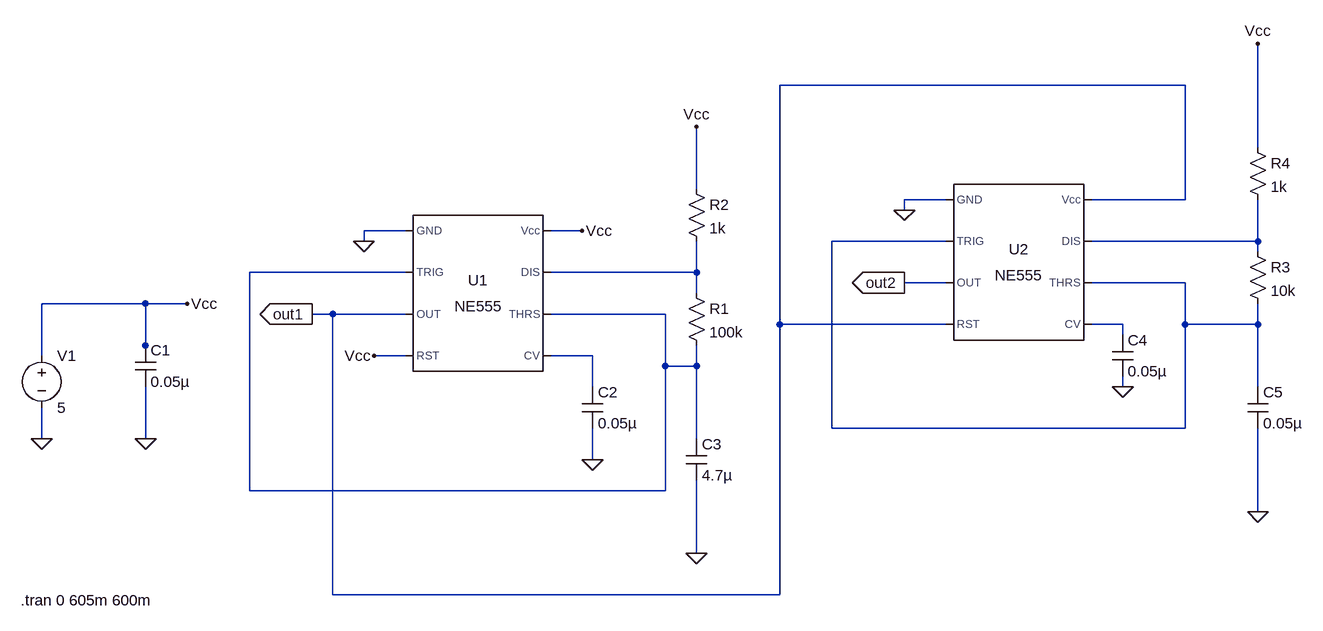
[diagram p0: schematic Double_Astable_Multivibrator.asc]
Double_Astable_Multivibrator.asc, the LTspice schematic file:
Version 4
SHEET 1 1996 680
WIRE 1680 -304 1056 -304
WIRE 1792 -208 1792 -368
WIRE 928 -144 928 -240
WIRE 1312 -128 1248 -128
WIRE 1680 -128 1680 -304
WIRE 1680 -128 1536 -128
WIRE 1248 -112 1248 -128
WIRE 480 -80 416 -80
WIRE 752 -80 704 -80
WIRE 416 -64 416 -80
WIRE 1312 -64 1136 -64
WIRE 1792 -64 1792 -128
WIRE 1792 -64 1536 -64
WIRE 1792 -48 1792 -64
WIRE 480 -16 240 -16
WIRE 928 -16 928 -64
WIRE 928 -16 704 -16
WIRE 1312 0 1248 0
WIRE 1680 0 1536 0
WIRE 928 16 928 -16
WIRE 80 32 -80 32
WIRE 144 32 80 32
WIRE 368 48 336 48
WIRE 480 48 368 48
WIRE 880 48 704 48
WIRE 1056 64 1056 -304
WIRE 1312 64 1056 64
WIRE 1584 64 1536 64
WIRE 1680 64 1680 0
WIRE 1792 64 1792 32
WIRE 1792 64 1680 64
WIRE 1584 80 1584 64
WIRE 80 96 80 32
WIRE -80 112 -80 32
WIRE 80 112 80 96
WIRE 480 112 432 112
WIRE 768 112 704 112
WIRE 880 128 880 48
WIRE 928 128 928 96
WIRE 928 128 880 128
WIRE 768 160 768 112
WIRE 1584 160 1584 144
WIRE 1792 160 1792 64
WIRE 1136 224 1136 -64
WIRE 1680 224 1680 64
WIRE 1680 224 1136 224
WIRE -80 240 -80 192
WIRE 80 240 80 160
WIRE 928 240 928 128
WIRE 768 272 768 224
WIRE 240 320 240 -16
WIRE 880 320 880 128
WIRE 880 320 240 320
WIRE 1792 352 1792 224
WIRE 928 416 928 304
WIRE 368 480 368 48
WIRE 1056 480 1056 64
WIRE 1056 480 368 480
FLAG -80 240 0
FLAG 80 240 0
FLAG 144 32 Vcc
FLAG 416 -64 0
FLAG 432 112 Vcc
FLAG 752 -80 Vcc
FLAG 768 272 0
FLAG 928 416 0
FLAG 928 -240 Vcc
FLAG 336 48 out1
IOPIN 336 48 Out
FLAG 1248 -112 0
FLAG 1248 0 out2
IOPIN 1248 0 Out
FLAG 1584 160 0
FLAG 1792 352 0
FLAG 1792 -368 Vcc
SYMBOL voltage -80 96 R0
WINDOW 123 0 0 Left 0
WINDOW 39 0 0 Left 0
SYMATTR InstName V1
SYMATTR Value 5
SYMBOL cap 64 96 R0
SYMATTR InstName C1
SYMATTR Value 0.05µ
SYMBOL Misc\\NE555 592 16 R0
SYMATTR InstName U1
SYMBOL cap 752 160 R0
SYMATTR InstName C2
SYMATTR Value 0.05µ
SYMBOL cap 912 240 R0
SYMATTR InstName C3
SYMATTR Value 4.7µ
SYMBOL res 912 0 R0
SYMATTR InstName R1
SYMATTR Value 100k
SYMBOL res 912 -160 R0
SYMATTR InstName R2
SYMATTR Value 1k
SYMBOL Misc\\NE555 1424 -32 R0
SYMATTR InstName U2
SYMBOL cap 1568 80 R0
SYMATTR InstName C4
SYMATTR Value 0.05µ
SYMBOL cap 1776 160 R0
SYMATTR InstName C5
SYMATTR Value 0.05µ
SYMBOL res 1776 -64 R0
SYMATTR InstName R3
SYMATTR Value 10k
SYMBOL res 1776 -224 R0
SYMATTR InstName R4
SYMATTR Value 1k
TEXT -112 488 Left 2 !.tran 0 605m 600m

The netlist it stands for:
* Double_Astable_Multivibrator.asc
V1 Vcc 0 5
C1 Vcc 0 0.05µ
XU1 0 N003 out1 Vcc N006 N003 N004 Vcc NE555  ; pins GND TRIG OUT RST CV THRS DIS Vcc
C2 N006 0 0.05µ
C3 N003 0 4.7µ
R1 N004 N003 100k
R2 Vcc N004 1k
XU2 0 N001 out2 out1 N005 N001 N002 out1 NE555  ; pins GND TRIG OUT RST CV THRS DIS Vcc
C4 N005 0 0.05µ
C5 N001 0 0.05µ
R3 N002 N001 10k
R4 Vcc N002 1k
.tran 0 605m 600m
.lib NE555.sub
.backanno
.end